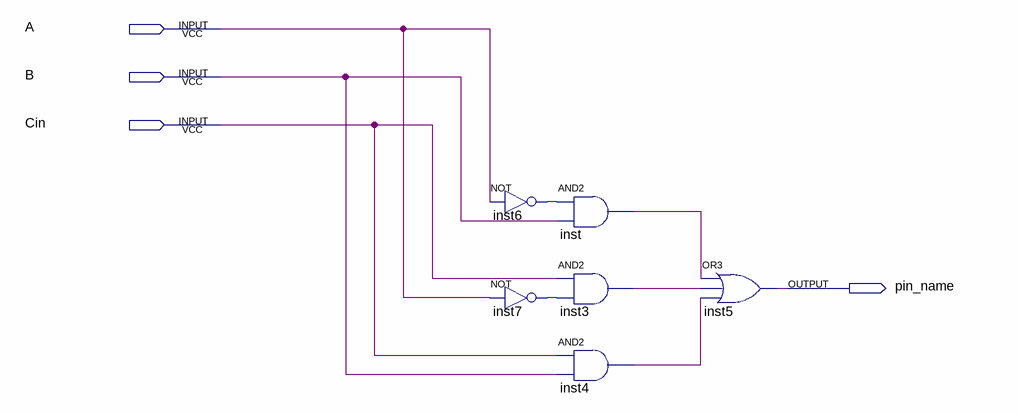
[diagram p0: schematic sheet]
// Quartus schematic menorQue.bdf as structural Verilog: 6 symbols, 4 pins
module menorQue (
  input  A,
  input  B,
  input  Cin,
  output pin_name
);

  wire inst3_out, inst4_out, inst6_out, inst7_out, inst_out;

  not inst6 (inst6_out, A);
  not inst7 (inst7_out, A);
  and inst (inst_out, inst6_out, B);
  and inst3 (inst3_out, Cin, inst7_out);
  and inst4 (inst4_out, Cin, B);
  or inst5 (pin_name, inst_out, inst3_out, inst4_out);
endmodule
